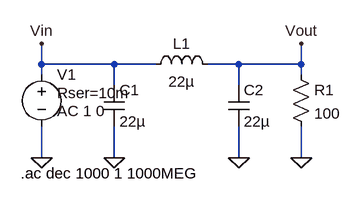
[diagram p0: schematic p5pifilter.asc]
p5pifilter.asc, the LTspice schematic file:
Version 4
SHEET 1 880 680
WIRE -16 80 -16 48
WIRE 96 80 -16 80
WIRE 160 80 96 80
WIRE 288 80 240 80
WIRE 384 80 384 48
WIRE 384 80 288 80
WIRE -16 96 -16 80
WIRE 384 96 384 80
WIRE 96 112 96 80
WIRE 288 112 288 80
WIRE -16 224 -16 176
WIRE 96 224 96 176
WIRE 288 224 288 176
WIRE 384 224 384 176
FLAG 96 224 0
FLAG 288 224 0
FLAG -16 224 0
FLAG -16 48 Vin
FLAG 384 48 Vout
FLAG 384 224 0
SYMBOL cap 80 112 R0
SYMATTR InstName C1
SYMATTR Value 22µ
SYMBOL cap 272 112 R0
SYMATTR InstName C2
SYMATTR Value 22µ
SYMBOL ind 144 96 R270
WINDOW 0 32 56 VTop 2
WINDOW 3 5 56 VBottom 2
SYMATTR InstName L1
SYMATTR Value 22µ
SYMBOL voltage -16 80 R0
WINDOW 3 24 44 Left 2
WINDOW 123 24 72 Left 2
WINDOW 39 24 44 Left 2
SYMATTR Value ""
SYMATTR Value2 AC 1 0
SYMATTR SpiceLine Rser=10m
SYMATTR InstName V1
SYMBOL res 368 80 R0
SYMATTR InstName R1
SYMATTR Value 100
TEXT -48 248 Left 2 !.ac dec 1000 1 1000MEG

The netlist it stands for:
* p5pifilter.asc
C1 Vin 0 22µ
C2 Vout 0 22µ
L1 Vin Vout 22µ
V1 Vin 0 AC 1 0 Rser=10m
R1 Vout 0 100
.ac dec 1000 1 1000MEG
.backanno
.end

* Results of the author's LTspice run, read from the files saved beside the schematic
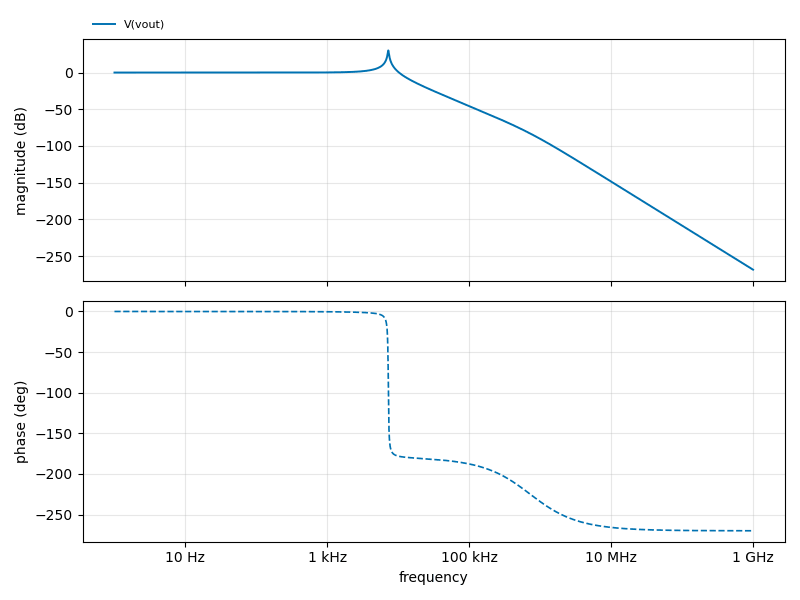
[diagram p1: AC Analysis of p5pifilter.asc, plotted from the saved traces]
* AC Analysis, 1 run:
*   V(vout): -0.00 dB at 1 Hz, -268.44 dB at 1 GHz, peak 30.16 dB at 7.228 kHz, 3 dB below the peak at 7.12 kHz and 7.345 kHz